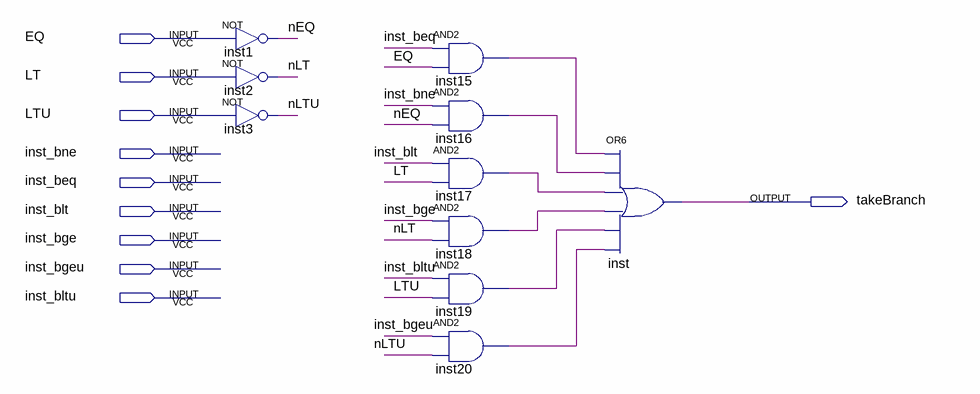
[diagram p0: schematic sheet]
// Quartus schematic BranchCondition.bdf as structural Verilog: 10 symbols, 10 pins
module BranchCondition (
  input  EQ,
  input  LT,
  input  LTU,
  input  inst_bne,
  input  inst_beq,
  input  inst_blt,
  input  inst_bge,
  input  inst_bgeu,
  input  inst_bltu,
  output takeBranch
);

  wire inst15_out, inst16_out, inst17_out, inst18_out, inst19_out, inst20_out, nEQ, nLT, nLTU;

  not inst1 (nEQ, EQ);
  not inst2 (nLT, LT);
  not inst3 (nLTU, LTU);
  and inst15 (inst15_out, inst_beq, EQ);
  and inst16 (inst16_out, inst_bne, nEQ);
  and inst17 (inst17_out, inst_blt, LT);
  and inst18 (inst18_out, inst_bge, nLT);
  and inst19 (inst19_out, inst_bltu, LTU);
  and inst20 (inst20_out, inst_bgeu, nLTU);
  or inst (takeBranch, inst15_out, inst16_out, inst17_out, inst18_out, inst19_out, inst20_out);
endmodule
